# EAGLE design LM75 Breakout wDrill (EAGLE 7.2.0)
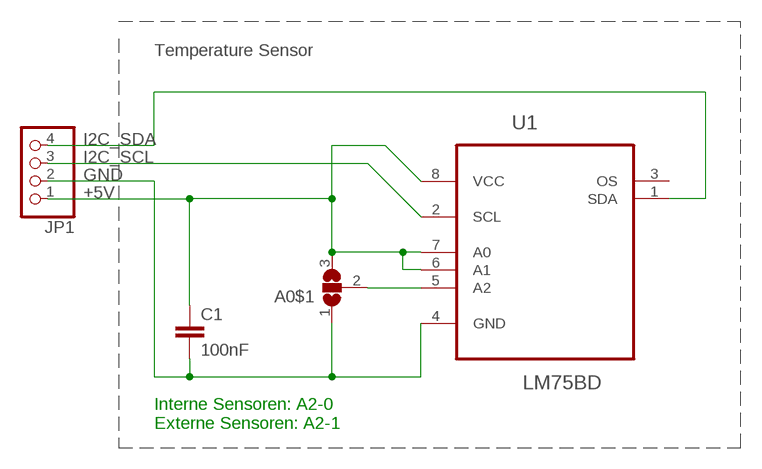
[diagram p0: schematic, sheet 1]

## Parts
A0$1  SJ2W  [SJ_2]
C1  100nF  C-EUC0805  [C0805]
JP1  PINHD-1X4  [1X04]
U1  LM75BD  [SOIC127P600X175-8N]

## Nets
+5V: A0$1.3 C1.1 JP1.1 U1.6(A1) U1.7(A0) U1.8(VCC)
GND: A0$1.1 C1.2 JP1.2 U1.4(GND)
I2C_SCL: JP1.3 U1.2(SCL)
I2C_SDA: JP1.4 U1.1(SDA)
N$1: A0$1.2 U1.5(A2)
Unconnected: U1.3(OS)

## Notes on the sheet
- Temperature Sensor
- Interne Sensoren: A2-0
  Externe Sensoren: A2-1

## Library data of the parts
A0$1 = jumper:SJ2W: SMD solder JUMPER
C1 = rcl:C-EU: CAPACITOR, European symbol
JP1 = pinhead:PINHD-1X4: PIN HEADER
U1 = NXP_By_element14_Batch_1:LM75BD: Digital temperature sensor and thermal watchdog; MPN: LM75BD; OC_FARNELL: 1854077; OC_NEWARK: 39T1312; PACKAGE: SO-8; SUPPLIER: NXP

## Board
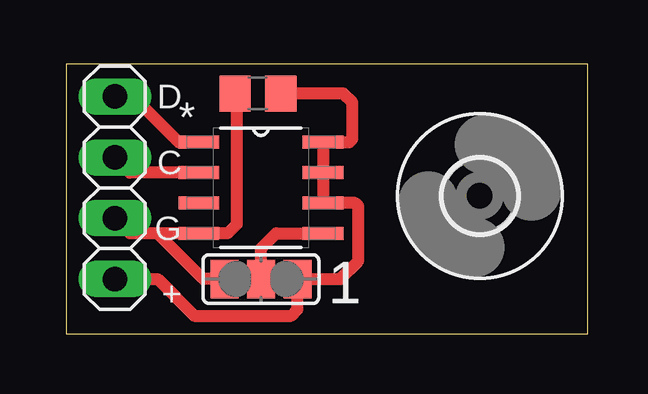
[diagram p1: board, top side]

Size 21.75 x 11.25 mm. Coordinates in mm from the lower left corner, seen from the top.
Outline: 0,0 21.75,0 21.75,11.25 0,11.25 0,0
Copper layers (1*16): Top 0.035mm / dielectric 1.5mm / Bottom 0.035mm
Design rules "default *": minimum track width 10mil, minimum drill 24mil, track to track 8mil, track to pad 8mil, pad to pad 8mil, via to via 8mil, smd to smd 8mil, copper to edge 0.5mm, drill to drill 8mil, minimum pad ring 10mil, minimum via ring 8mil, stop-mask expansion 4mil, vias tented up to drill 0mil, thermal gap 10mil

### Footprints (pad centres in the part's own frame; a part is rotated, then mirrored left to right if it is on the bottom)
SJ_2 = smd 1.168 x 1.6: 1 -1.524,0; 2 0,0; 3 1.524,0
C0805 = smd 1.3 x 1.5: 1 -0.95,0; 2 0.95,0
1X04 = drill 1.016 long: 1 -3.81,0; 2 -1.27,0; 3 1.27,0; 4 3.81,0
SOIC127P600X175-8N = smd 1.702 x 0.533: 1 -2.591,1.905; 2 -2.591,0.635; 3 -2.591,-0.635; 4 -2.591,-1.905; 5 2.591,-1.905; 6 2.591,-0.635; 7 2.591,0.635; 8 2.591,1.905
3,0 = hole 3: 0,0

### Placement (x,y rotation side)
A0$1  8.12,2.28 0 top
C1  8,10.03 180 top
JP1  2.03,6.09 90 top
U1  8.12,6.09 0 top
U$1  [3,0]  17.25,5.75 0 top

### Tracks (layer width: path | path; a pad name or v marks a point on that pad's centre or on a via)
+5V
  Top 0.508: JP1.1 3.81,2.28 5.33,0.76 9.39,0.76 9.65,1.01 A0$1.3 11.43,2.28 12.19,3.04 12.19,5.33 12.06,5.46 U1.6 U1.7 U1.8 11.81,8 11.93,8.12 11.93,9.65 11.55,10.03 C1.1
GND
  Top 0.508: 3.81,4.19 U1.4 6.73,4.19 7.11,4.57 7.11,9.97 C1.2 | 3.81,4.19 2.66,4.19 JP1.2 | A0$1.1 5.71,2.28 3.81,4.19
I2C_SCL
  Top 0.508: U1.2 2.66,6.73 JP1.3
I2C_SDA
  Top 0.508: U1.1 4.7,8 2.79,9.9 JP1.4
N$1
  Top 0.508: A0$1.2 8.12,3.55 8.76,4.19 U1.5

### Text on the board
tPlace: D / C / G / + | 1